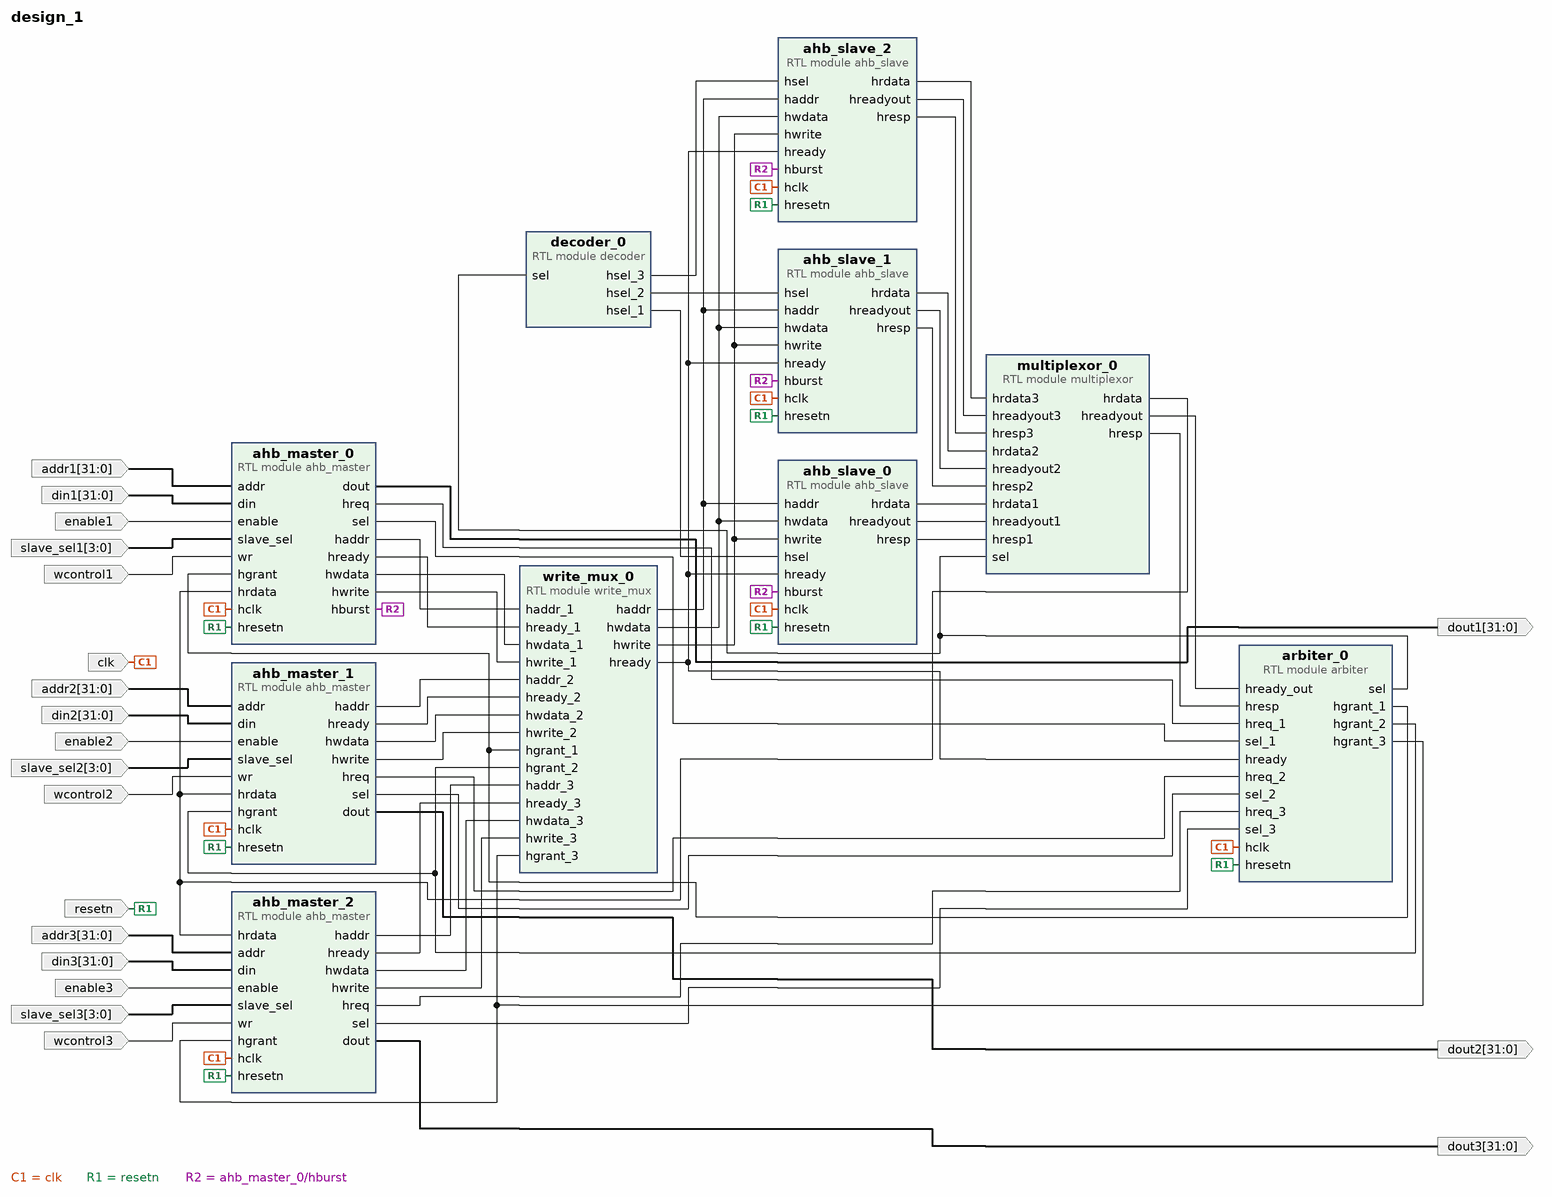
[diagram p0: block diagram of the top level]
# Vivado block design design_1, xc7z020clg484-1, Vivado 2019.1
create_bd_design design_1

create_bd_port -dir I -from 31 -to 0 -type data addr1
create_bd_port -dir I -from 31 -to 0 addr2
create_bd_port -dir I -from 31 -to 0 addr3
create_bd_port -dir I -type clk clk
set_property -dict {CONFIG.FREQ_HZ 20000000} [get_bd_ports clk]
create_bd_port -dir I -from 31 -to 0 din1
create_bd_port -dir I -from 31 -to 0 -type data din2
create_bd_port -dir I -from 31 -to 0 -type data din3
create_bd_port -dir O -from 31 -to 0 -type data dout1
create_bd_port -dir O -from 31 -to 0 -type data dout2
create_bd_port -dir O -from 31 -to 0 -type data dout3
create_bd_port -dir I enable1
create_bd_port -dir I enable2
create_bd_port -dir I enable3
create_bd_port -dir I -type rst resetn
set_property -dict {CONFIG.POLARITY ACTIVE_LOW} [get_bd_ports resetn]
create_bd_port -dir I -from 3 -to 0 -type data slave_sel1
create_bd_port -dir I -from 3 -to 0 -type data slave_sel2
create_bd_port -dir I -from 3 -to 0 -type data slave_sel3
create_bd_port -dir I wcontrol1
create_bd_port -dir I wcontrol2
create_bd_port -dir I wcontrol3

create_bd_cell -type module -reference ahb_master ahb_master_0
create_bd_cell -type module -reference ahb_master ahb_master_1
create_bd_cell -type module -reference ahb_master ahb_master_2
create_bd_cell -type module -reference ahb_slave ahb_slave_0
create_bd_cell -type module -reference ahb_slave ahb_slave_1
create_bd_cell -type module -reference ahb_slave ahb_slave_2
create_bd_cell -type module -reference arbiter arbiter_0
create_bd_cell -type module -reference decoder decoder_0
create_bd_cell -type module -reference multiplexor multiplexor_0
create_bd_cell -type module -reference write_mux write_mux_0

# ---- connections ----

connect_bd_net [get_bd_ports clk] \
  [get_bd_pins ahb_master_0/hclk] [get_bd_pins ahb_master_1/hclk] [get_bd_pins ahb_master_2/hclk] \
  [get_bd_pins ahb_slave_0/hclk] [get_bd_pins ahb_slave_1/hclk] [get_bd_pins ahb_slave_2/hclk] [get_bd_pins arbiter_0/hclk]
connect_bd_net [get_bd_ports resetn] \
  [get_bd_pins ahb_master_0/hresetn] [get_bd_pins ahb_master_1/hresetn] [get_bd_pins ahb_master_2/hresetn] \
  [get_bd_pins ahb_slave_0/hresetn] [get_bd_pins ahb_slave_1/hresetn] [get_bd_pins ahb_slave_2/hresetn] \
  [get_bd_pins arbiter_0/hresetn]
connect_bd_net -net addr1_1 [get_bd_ports addr1] [get_bd_pins ahb_master_0/addr]
connect_bd_net -net addr2_1 [get_bd_ports addr2] [get_bd_pins ahb_master_1/addr]
connect_bd_net -net addr3_1 [get_bd_ports addr3] [get_bd_pins ahb_master_2/addr]
connect_bd_net [get_bd_pins ahb_master_0/dout] [get_bd_ports dout1]
connect_bd_net [get_bd_pins ahb_master_0/haddr] [get_bd_pins write_mux_0/haddr_1]
connect_bd_net [get_bd_pins ahb_master_0/hburst] [get_bd_pins ahb_slave_0/hburst] [get_bd_pins ahb_slave_1/hburst] [get_bd_pins ahb_slave_2/hburst]
connect_bd_net [get_bd_pins ahb_master_0/hready] [get_bd_pins write_mux_0/hready_1]
connect_bd_net [get_bd_pins ahb_master_0/hreq] [get_bd_pins arbiter_0/hreq_1]
connect_bd_net [get_bd_pins ahb_master_0/hwdata] [get_bd_pins write_mux_0/hwdata_1]
connect_bd_net [get_bd_pins ahb_master_0/hwrite] [get_bd_pins write_mux_0/hwrite_1]
connect_bd_net [get_bd_pins ahb_master_0/sel] [get_bd_pins arbiter_0/sel_1]
connect_bd_net [get_bd_pins ahb_master_1/dout] [get_bd_ports dout2]
connect_bd_net [get_bd_pins ahb_master_1/haddr] [get_bd_pins write_mux_0/haddr_2]
connect_bd_net [get_bd_pins ahb_master_1/hready] [get_bd_pins write_mux_0/hready_2]
connect_bd_net [get_bd_pins ahb_master_1/hreq] [get_bd_pins arbiter_0/hreq_2]
connect_bd_net [get_bd_pins ahb_master_1/hwdata] [get_bd_pins write_mux_0/hwdata_2]
connect_bd_net [get_bd_pins ahb_master_1/hwrite] [get_bd_pins write_mux_0/hwrite_2]
connect_bd_net [get_bd_pins ahb_master_1/sel] [get_bd_pins arbiter_0/sel_2]
connect_bd_net [get_bd_pins ahb_master_2/dout] [get_bd_ports dout3]
connect_bd_net [get_bd_pins ahb_master_2/haddr] [get_bd_pins write_mux_0/haddr_3]
connect_bd_net [get_bd_pins ahb_master_2/hready] [get_bd_pins write_mux_0/hready_3]
connect_bd_net [get_bd_pins ahb_master_2/hreq] [get_bd_pins arbiter_0/hreq_3]
connect_bd_net [get_bd_pins ahb_master_2/hwdata] [get_bd_pins write_mux_0/hwdata_3]
connect_bd_net [get_bd_pins ahb_master_2/hwrite] [get_bd_pins write_mux_0/hwrite_3]
connect_bd_net [get_bd_pins ahb_master_2/sel] [get_bd_pins arbiter_0/sel_3]
connect_bd_net [get_bd_pins ahb_slave_0/hrdata] [get_bd_pins multiplexor_0/hrdata1]
connect_bd_net [get_bd_pins ahb_slave_0/hreadyout] [get_bd_pins multiplexor_0/hreadyout1]
connect_bd_net [get_bd_pins ahb_slave_0/hresp] [get_bd_pins multiplexor_0/hresp1]
connect_bd_net [get_bd_pins ahb_slave_1/hrdata] [get_bd_pins multiplexor_0/hrdata2]
connect_bd_net [get_bd_pins ahb_slave_1/hreadyout] [get_bd_pins multiplexor_0/hreadyout2]
connect_bd_net [get_bd_pins ahb_slave_1/hresp] [get_bd_pins multiplexor_0/hresp2]
connect_bd_net [get_bd_pins ahb_slave_2/hrdata] [get_bd_pins multiplexor_0/hrdata3]
connect_bd_net [get_bd_pins ahb_slave_2/hreadyout] [get_bd_pins multiplexor_0/hreadyout3]
connect_bd_net [get_bd_pins ahb_slave_2/hresp] [get_bd_pins multiplexor_0/hresp3]
connect_bd_net [get_bd_pins arbiter_0/hgrant_1] [get_bd_pins ahb_master_0/hgrant] [get_bd_pins write_mux_0/hgrant_1]
connect_bd_net [get_bd_pins arbiter_0/hgrant_2] [get_bd_pins ahb_master_1/hgrant] [get_bd_pins write_mux_0/hgrant_2]
connect_bd_net [get_bd_pins arbiter_0/hgrant_3] [get_bd_pins ahb_master_2/hgrant] [get_bd_pins write_mux_0/hgrant_3]
connect_bd_net [get_bd_pins arbiter_0/sel] [get_bd_pins decoder_0/sel] [get_bd_pins multiplexor_0/sel]
connect_bd_net [get_bd_pins decoder_0/hsel_1] [get_bd_pins ahb_slave_0/hsel]
connect_bd_net [get_bd_pins decoder_0/hsel_2] [get_bd_pins ahb_slave_1/hsel]
connect_bd_net [get_bd_pins decoder_0/hsel_3] [get_bd_pins ahb_slave_2/hsel]
connect_bd_net -net din1_1 [get_bd_ports din1] [get_bd_pins ahb_master_0/din]
connect_bd_net -net din2_1 [get_bd_ports din2] [get_bd_pins ahb_master_1/din]
connect_bd_net -net din3_1 [get_bd_ports din3] [get_bd_pins ahb_master_2/din]
connect_bd_net -net enable1_1 [get_bd_ports enable1] [get_bd_pins ahb_master_0/enable]
connect_bd_net -net enable2_1 [get_bd_ports enable2] [get_bd_pins ahb_master_1/enable]
connect_bd_net -net enable3_1 [get_bd_ports enable3] [get_bd_pins ahb_master_2/enable]
connect_bd_net [get_bd_pins multiplexor_0/hrdata] \
  [get_bd_pins ahb_master_0/hrdata] [get_bd_pins ahb_master_1/hrdata] [get_bd_pins ahb_master_2/hrdata]
connect_bd_net [get_bd_pins multiplexor_0/hreadyout] [get_bd_pins arbiter_0/hready_out]
connect_bd_net [get_bd_pins multiplexor_0/hresp] [get_bd_pins arbiter_0/hresp]
connect_bd_net -net slave_sel1_1 [get_bd_ports slave_sel1] [get_bd_pins ahb_master_0/slave_sel]
connect_bd_net -net slave_sel2_1 [get_bd_ports slave_sel2] [get_bd_pins ahb_master_1/slave_sel]
connect_bd_net -net slave_sel3_1 [get_bd_ports slave_sel3] [get_bd_pins ahb_master_2/slave_sel]
connect_bd_net -net wcontrol1_1 [get_bd_ports wcontrol1] [get_bd_pins ahb_master_0/wr]
connect_bd_net -net wcontrol2_1 [get_bd_ports wcontrol2] [get_bd_pins ahb_master_1/wr]
connect_bd_net -net wcontrol3_1 [get_bd_ports wcontrol3] [get_bd_pins ahb_master_2/wr]
connect_bd_net [get_bd_pins write_mux_0/haddr] [get_bd_pins ahb_slave_0/haddr] [get_bd_pins ahb_slave_1/haddr] [get_bd_pins ahb_slave_2/haddr]
connect_bd_net [get_bd_pins write_mux_0/hready] \
  [get_bd_pins ahb_slave_0/hready] [get_bd_pins ahb_slave_1/hready] [get_bd_pins ahb_slave_2/hready] \
  [get_bd_pins arbiter_0/hready]
connect_bd_net [get_bd_pins write_mux_0/hwdata] [get_bd_pins ahb_slave_0/hwdata] [get_bd_pins ahb_slave_1/hwdata] [get_bd_pins ahb_slave_2/hwdata]
connect_bd_net [get_bd_pins write_mux_0/hwrite] [get_bd_pins ahb_slave_0/hwrite] [get_bd_pins ahb_slave_1/hwrite] [get_bd_pins ahb_slave_2/hwrite]

validate_bd_design
save_bd_design
